# EAGLE schematic PCB-111000_breadboard (EAGLE 9.7.0)
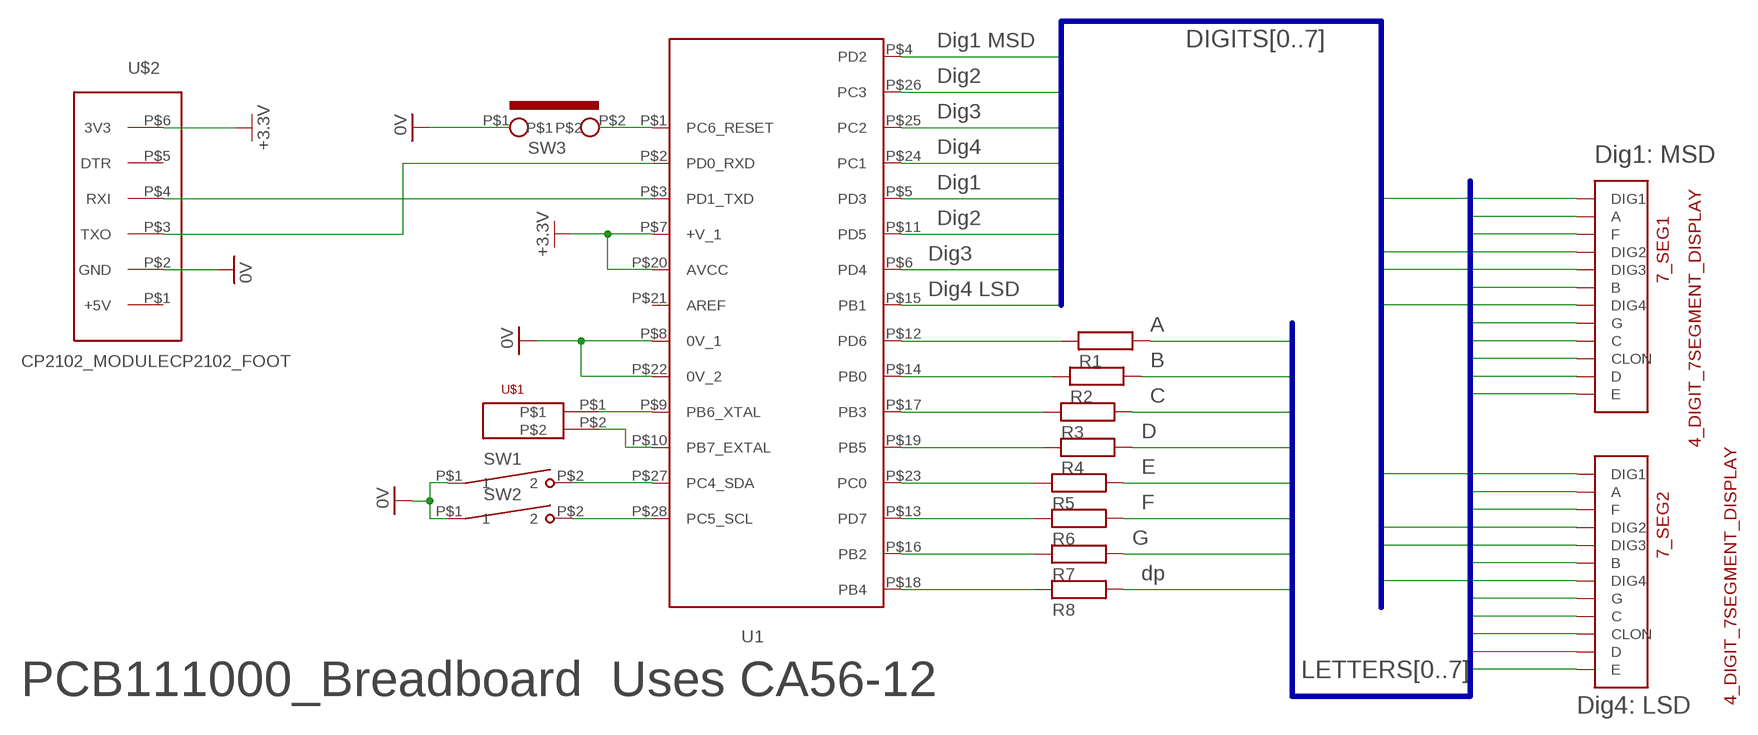
[diagram p0: schematic, sheet 1]

## Parts
7_SEG1  4_DIGIT_7SEGMENT_DISPLAY  [4_DIGIT_7SEGMENT_DISPLAY]
7_SEG2  4_DIGIT_7SEGMENT_DISPLAY  [4_DIGIT_7SEGMENT_DISPLAY]
R1  RESISTOR1206  [1206]
R2  RESISTOR1206  [1206]
R3  RESISTOR1206  [1206]
R4  RESISTOR1206  [1206]
R5  RESISTOR1206  [1206]
R6  RESISTOR1206  [1206]
R7  RESISTOR1206  [1206]
R8  RESISTOR1206  [1206]
SW1  IO_SWITCHIO_SWITCH  [IO_SWITCH]
SW2  IO_SWITCHIO_SWITCH  [IO_SWITCH]
SW3  RESET_SWITCHRESET_SWITCH  [RESET_SWITCH]
U1  MY_ATMEGA168DIP_28  [DIP_28]
U$1  XTAL  [XTAL_VIAS]
U$2  CP2102_MODULECP2102_FOOT  [CP2102_FOOT]

## Nets
0V: SW1.P$1 SW2.P$1 SW3.P$1 U1.P$8(0V_1) U1.P$22(0V_2) U$2.P$2(GND)
+3.3V: U1.P$7(+V_1) U1.P$20(AVCC) U$2.P$6(3V3)
DIGITS0: 7_SEG1.P$12(DIG1) U1.P$4(PD2)
DIGITS1: 7_SEG1.P$9(DIG2) U1.P$26(PC3)
DIGITS2: 7_SEG1.P$8(DIG3) U1.P$25(PC2)
DIGITS3: 7_SEG1.P$6(DIG4) U1.P$24(PC1)
DIGITS4: 7_SEG2.P$12(DIG1) U1.P$5(PD3)
DIGITS5: 7_SEG2.P$9(DIG2) U1.P$11(PD5)
DIGITS6: 7_SEG2.P$8(DIG3) U1.P$6(PD4)
DIGITS7: 7_SEG2.P$6(DIG4) U1.P$15(PB1)
LETTERS0: 7_SEG1.P$11(A) 7_SEG2.P$11(A) R1.P$2
LETTERS1: 7_SEG1.P$7(B) 7_SEG2.P$7(B) R2.P$2
LETTERS2: 7_SEG1.P$4(C) 7_SEG2.P$4(C) R3.P$2
LETTERS3: 7_SEG1.P$2(D) 7_SEG2.P$2(D) R4.P$2
LETTERS4: 7_SEG1.P$1(E) 7_SEG2.P$1(E) R5.P$2
LETTERS5: 7_SEG1.P$10(F) 7_SEG2.P$10(F) R6.P$2
LETTERS6: 7_SEG1.P$5(G) 7_SEG2.P$5(G) R7.P$2
LETTERS7: 7_SEG1.P$3(CLON) 7_SEG2.P$3(CLON) R8.P$2
N$1: R1.P$1 U1.P$12(PD6)
N$2: R2.P$1 U1.P$14(PB0)
N$3: R3.P$1 U1.P$17(PB3)
N$4: R4.P$1 U1.P$19(PB5)
N$5: R5.P$1 U1.P$23(PC0)
N$6: R6.P$1 U1.P$13(PD7)
N$7: R7.P$1 U1.P$16(PB2)
N$8: R8.P$1 U1.P$18(PB4)
N$13: U1.P$9(PB6_XTAL) U$1.P$1
N$14: U1.P$10(PB7_EXTAL) U$1.P$2
N$15: SW3.P$2 U1.P$1(PC6_RESET)
N$16: U1.P$2(PD0_RXD) U$2.P$3(TXO)
N$17: U1.P$3(PD1_TXD) U$2.P$4(RXI)
N$18: SW1.P$2 U1.P$27(PC4_SDA)
N$19: SW2.P$2 U1.P$28(PC5_SCL)
Unconnected: U1.P$21(AREF) U$2.P$1(+5V) U$2.P$5(DTR)

## Buses
LETTERS[0..7]
DIGITS[0..7]

## Notes on the sheet
- Dig1 MSD
- Dig2
- Dig3
- Dig4
- Dig1: MSD
- Dig1
- Dig2
- Dig3
- Dig4 LSD
- A
- B
- C
- D
- E
- F
- G
- dp
- PCB111000_Breadboard  Uses CA56-12
- Dig4: LSD

## Library data of the parts
7_SEG1 7_SEG2 = 1_marko:4_DIGIT_7SEGMENT_DISPLAY: Common Anode RE 55-1674
R1-R8 = My_Library:RESISTOR
SW1 SW2 = My_Library:IO_SWITCH
SW3 = My_Library:RESET_SWITCH
U1 = My_Library:MY_ATMEGA168
U$1 = 1_3V3_Bootloader:XTAL: Watch Crystal RS 478-9268
U$2 = My_Library:CP2102_MODULE